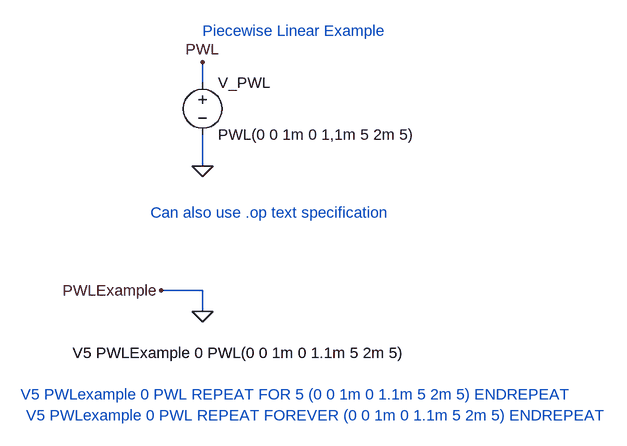
[diagram p0: schematic PWL_example.asc]
PWL_example.asc, the LTspice schematic file:
Version 4
SHEET 1 880 680
WIRE 64 96 64 64
WIRE 64 224 64 176
WIRE 64 416 0 416
WIRE 64 448 64 416
FLAG 64 224 0
FLAG 64 64 PWL
FLAG 64 448 0
FLAG 0 416 PWLExample
SYMBOL voltage 64 80 R0
WINDOW 123 0 0 Left 0
WINDOW 39 0 0 Left 0
SYMATTR InstName V_PWL
SYMATTR Value PWL(0 0 1m 0 1,1m 5 2m 5)
TEXT 64 16 Left 2 ;Piecewise Linear Example
TEXT -16 296 Left 2 ;Can also use .op text specification
TEXT -136 512 Left 2 !V5 PWLExample 0 PWL(0 0 1m 0 1.1m 5 2m 5)
TEXT -216 576 Left 2 ;V5 PWLexample 0 PWL REPEAT FOR 5 (0 0 1m 0 1.1m 5 2m 5) ENDREPEAT
TEXT -208 608 Left 2 ;V5 PWLexample 0 PWL REPEAT FOREVER (0 0 1m 0 1.1m 5 2m 5) ENDREPEAT

The netlist it stands for:
* PWL_example.asc
V_PWL PWL 0 PWL(0 0 1m 0 1,1m 5 2m 5)
* Piecewise Linear Example
* Can also use .op text specification
V5 PWLExample 0 PWL(0 0 1m 0 1.1m 5 2m 5)
* V5 PWLexample 0 PWL REPEAT FOR 5 (0 0 1m 0 1.1m 5 2m 5) ENDREPEAT
* V5 PWLexample 0 PWL REPEAT FOREVER (0 0 1m 0 1.1m 5 2m 5) ENDREPEAT
.backanno
.end